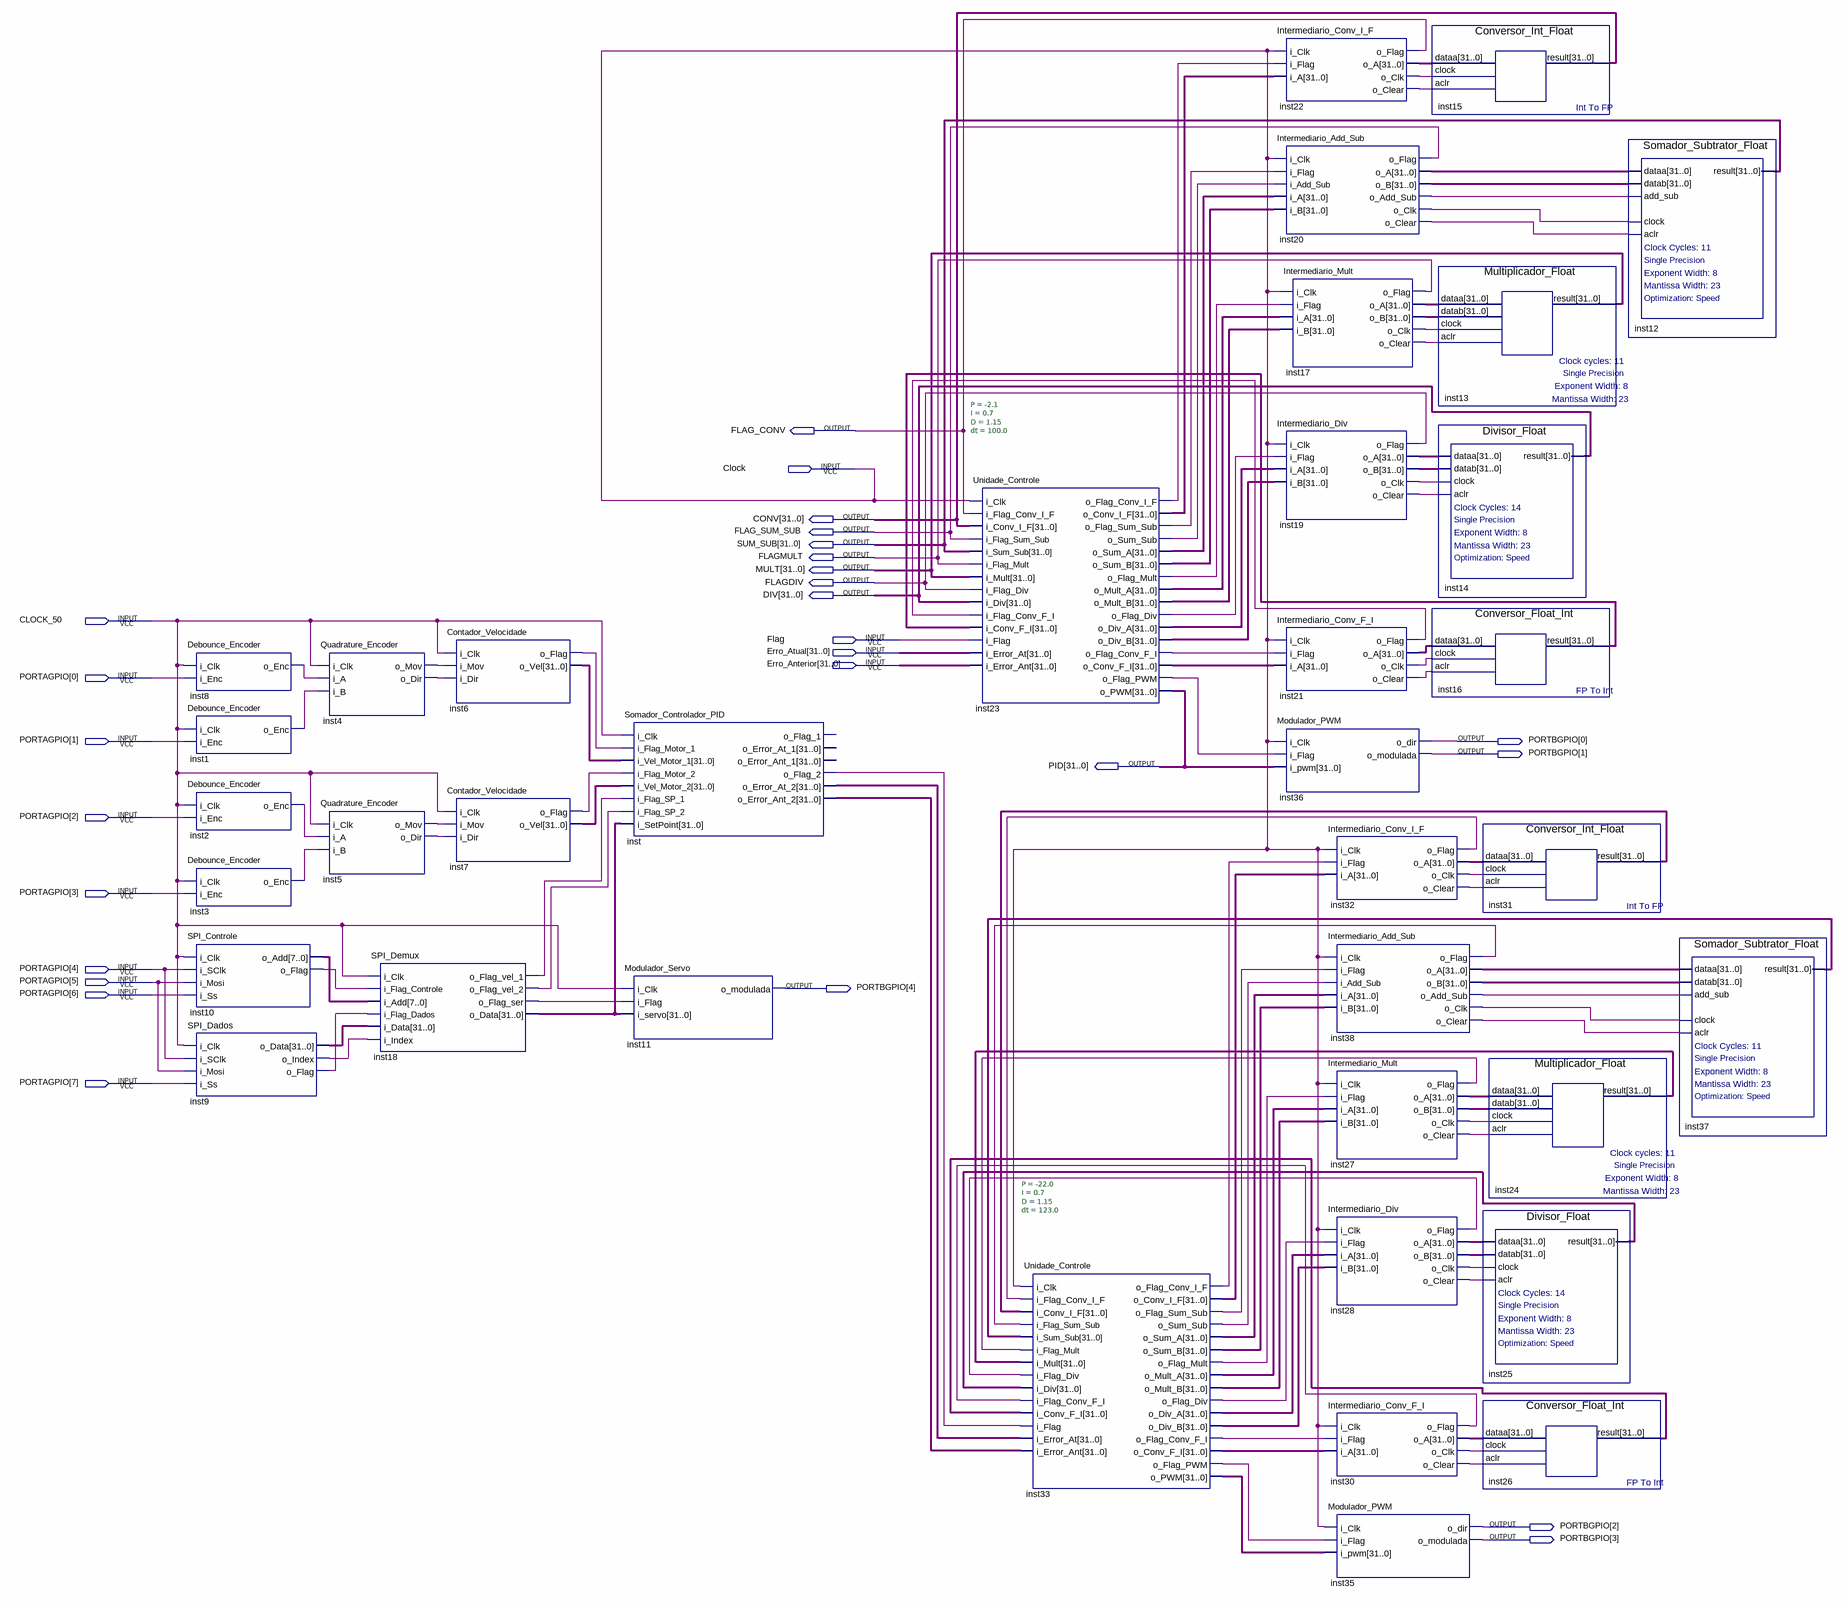
[diagram p0: schematic sheet]
// Quartus schematic Ackermann.bdf as structural Verilog: 37 symbols, 27 pins
module Ackermann (
  input  Clock,
  input  CLOCK_50,
  input  Flag,
  input  [31:0] Erro_Atual,
  input  [31:0] Erro_Anterior,
  input  [7:0] PORTAGPIO,
  output FLAG_CONV,
  output [31:0] CONV,
  output FLAG_SUM_SUB,
  output [31:0] SUM_SUB,
  output FLAGMULT,
  output [31:0] MULT,
  output FLAGDIV,
  output [31:0] DIV,
  output [4:0] PORTBGPIO,
  output [31:0] PID
);

  wire inst1_o_enc, inst2_o_enc, inst3_o_enc, inst4_o_dir, inst4_o_mov, inst5_o_dir, inst5_o_mov,
       inst6_o_flag, inst7_o_flag, inst8_o_enc, inst9_o_flag, inst9_o_index, inst10_o_flag, inst17_o_clear,
       inst17_o_clk, inst18_o_flag_ser, inst18_o_flag_vel_1, inst18_o_flag_vel_2, inst19_o_clear,
       inst19_o_clk, inst20_o_add_sub, inst20_o_clear, inst20_o_clk, inst21_o_clear, inst21_o_clk,
       inst21_o_flag, inst22_o_clear, inst22_o_clk, inst23_o_flag_conv_f_i, inst23_o_flag_conv_i_f,
       inst23_o_flag_div, inst23_o_flag_mult, inst23_o_flag_pwm, inst23_o_flag_sum_sub, inst23_o_sum_sub,
       inst27_o_clear, inst27_o_clk, inst27_o_flag, inst28_o_clear, inst28_o_clk, inst28_o_flag,
       inst30_o_clear, inst30_o_clk, inst30_o_flag, inst32_o_clear, inst32_o_clk, inst32_o_flag,
       inst33_o_flag_conv_f_i, inst33_o_flag_conv_i_f, inst33_o_flag_div, inst33_o_flag_mult,
       inst33_o_flag_pwm, inst33_o_flag_sum_sub, inst33_o_sum_sub, inst38_o_add_sub, inst38_o_clear,
       inst38_o_clk, inst38_o_flag, inst_o_flag_2;
  wire [7:0] inst10_o_add;
  wire [31:0] inst6_o_vel, inst7_o_vel, inst9_o_data, inst16_result, inst17_o_a, inst17_o_b, inst18_o_data,
       inst19_o_a, inst19_o_b, inst20_o_a, inst20_o_b, inst21_o_a, inst22_o_a, inst23_o_conv_f_i,
       inst23_o_conv_i_f, inst23_o_div_a, inst23_o_div_b, inst23_o_mult_a, inst23_o_mult_b, inst23_o_sum_a,
       inst23_o_sum_b, inst24_result, inst25_result, inst26_result, inst27_o_a, inst27_o_b, inst28_o_a,
       inst28_o_b, inst30_o_a, inst31_result, inst32_o_a, inst33_o_conv_f_i, inst33_o_conv_i_f,
       inst33_o_div_a, inst33_o_div_b, inst33_o_mult_a, inst33_o_mult_b, inst33_o_pwm, inst33_o_sum_a,
       inst33_o_sum_b, inst37_result, inst38_o_a, inst38_o_b, inst_o_error_ant_2, inst_o_error_at_2;

  Debounce_Encoder inst8 (.i_Clk(CLOCK_50), .i_Enc(PORTAGPIO[0]), .o_Enc(inst8_o_enc));
  Debounce_Encoder inst1 (.i_Clk(CLOCK_50), .i_Enc(PORTAGPIO[1]), .o_Enc(inst1_o_enc));
  Debounce_Encoder inst2 (.i_Clk(CLOCK_50), .i_Enc(PORTAGPIO[2]), .o_Enc(inst2_o_enc));
  Debounce_Encoder inst3 (.i_Clk(CLOCK_50), .i_Enc(PORTAGPIO[3]), .o_Enc(inst3_o_enc));
  SPI_Controle inst10 (
    .i_Clk(CLOCK_50), .i_SClk(PORTAGPIO[4]), .i_Mosi(PORTAGPIO[5]), .i_Ss(PORTAGPIO[6]),
    .o_Add(inst10_o_add), .o_Flag(inst10_o_flag));
  SPI_Dados inst9 (
    .i_Clk(CLOCK_50), .i_SClk(PORTAGPIO[4]), .i_Mosi(PORTAGPIO[5]), .i_Ss(PORTAGPIO[7]),
    .o_Data(inst9_o_data), .o_Index(inst9_o_index), .o_Flag(inst9_o_flag));
  Quadrature_Encoder inst4 (
    .i_Clk(CLOCK_50), .i_A(inst8_o_enc), .i_B(inst1_o_enc), .o_Mov(inst4_o_mov), .o_Dir(inst4_o_dir));
  Quadrature_Encoder inst5 (
    .i_Clk(CLOCK_50), .i_A(inst2_o_enc), .i_B(inst3_o_enc), .o_Mov(inst5_o_mov), .o_Dir(inst5_o_dir));
  SPI_Demux inst18 (
    .i_Clk(CLOCK_50), .i_Flag_Controle(inst10_o_flag), .i_Add(inst10_o_add), .i_Flag_Dados(inst9_o_flag),
    .i_Data(inst9_o_data), .i_Index(inst9_o_index), .o_Flag_vel_1(inst18_o_flag_vel_1),
    .o_Flag_vel_2(inst18_o_flag_vel_2), .o_Flag_ser(inst18_o_flag_ser), .o_Data(inst18_o_data));
  Contador_Velocidade inst6 (
    .i_Clk(CLOCK_50), .i_Mov(inst4_o_mov), .i_Dir(inst4_o_dir), .o_Flag(inst6_o_flag), .o_Vel(inst6_o_vel));
  Contador_Velocidade inst7 (
    .i_Clk(CLOCK_50), .i_Mov(inst5_o_mov), .i_Dir(inst5_o_dir), .o_Flag(inst7_o_flag), .o_Vel(inst7_o_vel));
  Somador_Controlador_PID inst (
    .i_Clk(CLOCK_50), .i_Flag_Motor_1(inst6_o_flag), .i_Vel_Motor_1(inst6_o_vel),
    .i_Flag_Motor_2(inst7_o_flag), .i_Vel_Motor_2(inst7_o_vel), .i_Flag_SP_1(inst18_o_flag_vel_1),
    .i_Flag_SP_2(inst18_o_flag_vel_2), .i_SetPoint(inst18_o_data), .o_Flag_2(inst_o_flag_2),
    .o_Error_Ant_2(inst_o_error_ant_2), .o_Error_At_2(inst_o_error_at_2));  // open: o_Flag_1, o_Error_Ant_1, o_Error_At_1
  Modulador_Servo inst11 (
    .i_Clk(CLOCK_50), .i_Flag(inst18_o_flag_ser), .i_servo(inst18_o_data), .o_modulada(PORTBGPIO[4]));
  Unidade_Controle #(.P(-2.1), .I(0.7), .D(1.15), .dt(100.0)) inst23 (
    .i_Clk(Clock), .i_Flag_Conv_I_F(FLAG_CONV), .i_Conv_I_F(CONV), .i_Flag_Sum_Sub(FLAG_SUM_SUB),
    .i_Sum_Sub(SUM_SUB), .i_Flag_Mult(FLAGMULT), .i_Mult(MULT), .i_Flag_Div(FLAGDIV), .i_Div(DIV),
    .i_Flag_Conv_F_I(inst21_o_flag), .i_Conv_F_I(inst16_result), .i_Flag(Flag), .i_Error_At(Erro_Atual),
    .i_Error_Ant(Erro_Anterior), .o_Flag_Conv_I_F(inst23_o_flag_conv_i_f), .o_Conv_I_F(inst23_o_conv_i_f),
    .o_Flag_Sum_Sub(inst23_o_flag_sum_sub), .o_Sum_Sub(inst23_o_sum_sub), .o_Sum_A(inst23_o_sum_a),
    .o_Sum_B(inst23_o_sum_b), .o_Flag_Mult(inst23_o_flag_mult), .o_Mult_A(inst23_o_mult_a),
    .o_Mult_B(inst23_o_mult_b), .o_Flag_Div(inst23_o_flag_div), .o_Div_A(inst23_o_div_a),
    .o_Div_B(inst23_o_div_b), .o_Flag_Conv_F_I(inst23_o_flag_conv_f_i), .o_Conv_F_I(inst23_o_conv_f_i),
    .o_Flag_PWM(inst23_o_flag_pwm), .o_PWM(PID));
  Unidade_Controle #(.P(-22.0), .I(0.7), .D(1.15), .dt(123.0)) inst33 (
    .i_Clk(Clock), .i_Flag_Conv_I_F(inst32_o_flag), .i_Conv_I_F(inst31_result),
    .i_Flag_Sum_Sub(inst38_o_flag), .i_Sum_Sub(inst37_result), .i_Flag_Mult(inst27_o_flag),
    .i_Mult(inst24_result), .i_Flag_Div(inst28_o_flag), .i_Div(inst25_result),
    .i_Flag_Conv_F_I(inst30_o_flag), .i_Conv_F_I(inst26_result), .i_Flag(inst_o_flag_2),
    .i_Error_At(inst_o_error_at_2), .i_Error_Ant(inst_o_error_ant_2),
    .o_Flag_Conv_I_F(inst33_o_flag_conv_i_f), .o_Conv_I_F(inst33_o_conv_i_f),
    .o_Flag_Sum_Sub(inst33_o_flag_sum_sub), .o_Sum_Sub(inst33_o_sum_sub), .o_Sum_A(inst33_o_sum_a),
    .o_Sum_B(inst33_o_sum_b), .o_Flag_Mult(inst33_o_flag_mult), .o_Mult_A(inst33_o_mult_a),
    .o_Mult_B(inst33_o_mult_b), .o_Flag_Div(inst33_o_flag_div), .o_Div_A(inst33_o_div_a),
    .o_Div_B(inst33_o_div_b), .o_Flag_Conv_F_I(inst33_o_flag_conv_f_i), .o_Conv_F_I(inst33_o_conv_f_i),
    .o_Flag_PWM(inst33_o_flag_pwm), .o_PWM(inst33_o_pwm));
  Intermediario_Conv_I_F inst22 (
    .i_Clk(Clock), .i_Flag(inst23_o_flag_conv_i_f), .i_A(inst23_o_conv_i_f), .o_Flag(FLAG_CONV),
    .o_A(inst22_o_a), .o_Clk(inst22_o_clk), .o_Clear(inst22_o_clear));
  Intermediario_Add_Sub inst20 (
    .i_Clk(Clock), .i_Flag(inst23_o_flag_sum_sub), .i_Add_Sub(inst23_o_sum_sub), .i_A(inst23_o_sum_a),
    .i_B(inst23_o_sum_b), .o_Flag(FLAG_SUM_SUB), .o_A(inst20_o_a), .o_B(inst20_o_b),
    .o_Add_Sub(inst20_o_add_sub), .o_Clk(inst20_o_clk), .o_Clear(inst20_o_clear));
  Intermediario_Mult inst17 (
    .i_Clk(Clock), .i_Flag(inst23_o_flag_mult), .i_A(inst23_o_mult_a), .i_B(inst23_o_mult_b),
    .o_Flag(FLAGMULT), .o_A(inst17_o_a), .o_B(inst17_o_b), .o_Clk(inst17_o_clk), .o_Clear(inst17_o_clear));
  Intermediario_Div inst19 (
    .i_Clk(Clock), .i_Flag(inst23_o_flag_div), .i_A(inst23_o_div_a), .i_B(inst23_o_div_b), .o_Flag(FLAGDIV),
    .o_A(inst19_o_a), .o_B(inst19_o_b), .o_Clk(inst19_o_clk), .o_Clear(inst19_o_clear));
  Intermediario_Conv_F_I inst21 (
    .i_Clk(Clock), .i_Flag(inst23_o_flag_conv_f_i), .i_A(inst23_o_conv_f_i), .o_Flag(inst21_o_flag),
    .o_A(inst21_o_a), .o_Clk(inst21_o_clk), .o_Clear(inst21_o_clear));
  Modulador_PWM inst36 (
    .i_Clk(Clock), .i_Flag(inst23_o_flag_pwm), .i_pwm(PID), .o_dir(PORTBGPIO[0]), .o_modulada(PORTBGPIO[1]));
  Intermediario_Conv_I_F inst32 (
    .i_Clk(Clock), .i_Flag(inst33_o_flag_conv_i_f), .i_A(inst33_o_conv_i_f), .o_Flag(inst32_o_flag),
    .o_A(inst32_o_a), .o_Clk(inst32_o_clk), .o_Clear(inst32_o_clear));
  Intermediario_Add_Sub inst38 (
    .i_Clk(Clock), .i_Flag(inst33_o_flag_sum_sub), .i_Add_Sub(inst33_o_sum_sub), .i_A(inst33_o_sum_a),
    .i_B(inst33_o_sum_b), .o_Flag(inst38_o_flag), .o_A(inst38_o_a), .o_B(inst38_o_b),
    .o_Add_Sub(inst38_o_add_sub), .o_Clk(inst38_o_clk), .o_Clear(inst38_o_clear));
  Intermediario_Mult inst27 (
    .i_Clk(Clock), .i_Flag(inst33_o_flag_mult), .i_A(inst33_o_mult_a), .i_B(inst33_o_mult_b),
    .o_Flag(inst27_o_flag), .o_A(inst27_o_a), .o_B(inst27_o_b), .o_Clk(inst27_o_clk), .o_Clear(inst27_o_clear));
  Intermediario_Div inst28 (
    .i_Clk(Clock), .i_Flag(inst33_o_flag_div), .i_A(inst33_o_div_a), .i_B(inst33_o_div_b),
    .o_Flag(inst28_o_flag), .o_A(inst28_o_a), .o_B(inst28_o_b), .o_Clk(inst28_o_clk), .o_Clear(inst28_o_clear));
  Intermediario_Conv_F_I inst30 (
    .i_Clk(Clock), .i_Flag(inst33_o_flag_conv_f_i), .i_A(inst33_o_conv_f_i), .o_Flag(inst30_o_flag),
    .o_A(inst30_o_a), .o_Clk(inst30_o_clk), .o_Clear(inst30_o_clear));
  Modulador_PWM inst35 (
    .i_Clk(Clock), .i_Flag(inst33_o_flag_pwm), .i_pwm(inst33_o_pwm), .o_dir(PORTBGPIO[2]),
    .o_modulada(PORTBGPIO[3]));
  Conversor_Int_Float inst15 (.dataa(inst22_o_a), .clock(inst22_o_clk), .aclr(inst22_o_clear), .result(CONV));
  Multiplicador_Float inst13 (
    .dataa(inst17_o_a), .datab(inst17_o_b), .clock(inst17_o_clk), .aclr(inst17_o_clear), .result(MULT));
  Divisor_Float inst14 (
    .dataa(inst19_o_a), .datab(inst19_o_b), .clock(inst19_o_clk), .aclr(inst19_o_clear), .result(DIV));
  Conversor_Float_Int inst16 (.dataa(inst21_o_a), .clock(inst21_o_clk), .aclr(inst21_o_clear), .result(inst16_result));
  Conversor_Int_Float inst31 (.dataa(inst32_o_a), .clock(inst32_o_clk), .aclr(inst32_o_clear), .result(inst31_result));
  Multiplicador_Float inst24 (
    .dataa(inst27_o_a), .datab(inst27_o_b), .clock(inst27_o_clk), .aclr(inst27_o_clear),
    .result(inst24_result));
  Divisor_Float inst25 (
    .dataa(inst28_o_a), .datab(inst28_o_b), .clock(inst28_o_clk), .aclr(inst28_o_clear),
    .result(inst25_result));
  Conversor_Float_Int inst26 (.dataa(inst30_o_a), .clock(inst30_o_clk), .aclr(inst30_o_clear), .result(inst26_result));
  Somador_Subtrator_Float inst12 (
    .dataa(inst20_o_a), .datab(inst20_o_b), .add_sub(inst20_o_add_sub), .clock(inst20_o_clk),
    .aclr(inst20_o_clear), .result(SUM_SUB));
  Somador_Subtrator_Float inst37 (
    .dataa(inst38_o_a), .datab(inst38_o_b), .add_sub(inst38_o_add_sub), .clock(inst38_o_clk),
    .aclr(inst38_o_clear), .result(inst37_result));
endmodule
